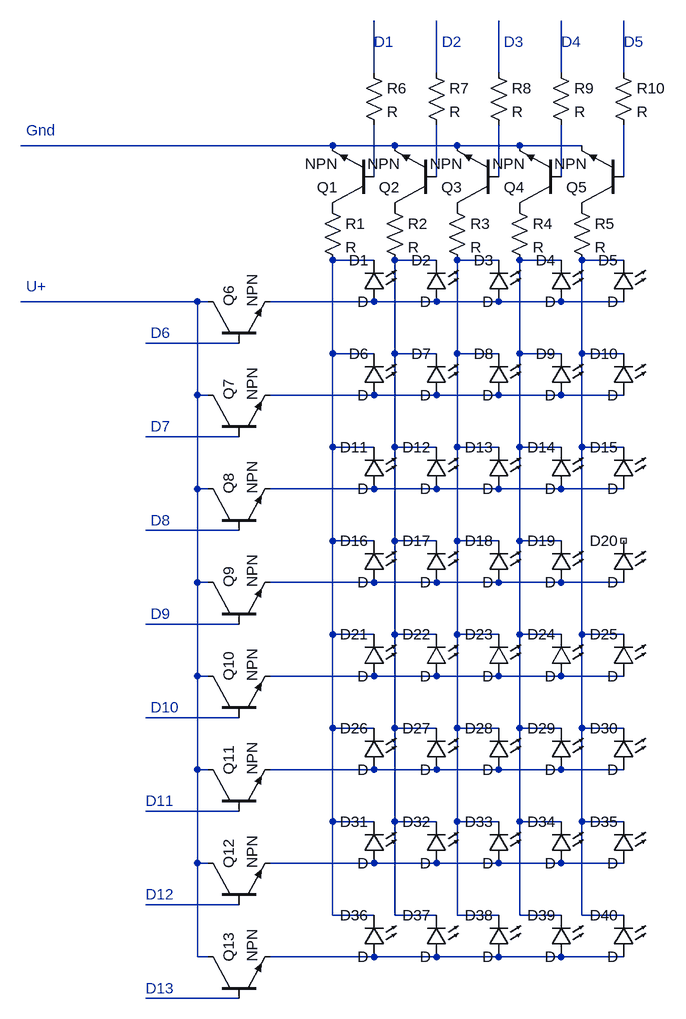
[diagram p0: schematic 5x8_LED_Matrix.asc]
5x8_LED_Matrix.asc, the LTspice schematic file:
Version 4
SHEET 1 880 1224
WIRE 112 -208 112 -288
WIRE 208 -208 208 -288
WIRE 304 -208 304 -288
WIRE 400 -208 400 -288
WIRE 496 -208 496 -288
WIRE 48 -96 -432 -96
WIRE 144 -96 48 -96
WIRE 240 -96 144 -96
WIRE 336 -96 240 -96
WIRE 432 -96 336 -96
WIRE 112 -48 112 -128
WIRE 208 -48 208 -128
WIRE 304 -48 304 -128
WIRE 400 -48 400 -128
WIRE 496 -48 496 -128
WIRE 112 80 48 80
WIRE 208 80 144 80
WIRE 304 80 240 80
WIRE 400 80 336 80
WIRE 496 80 432 80
WIRE -160 144 -432 144
WIRE -144 144 -160 144
WIRE 112 144 -48 144
WIRE 208 144 112 144
WIRE 304 144 208 144
WIRE 400 144 304 144
WIRE 496 144 400 144
WIRE -96 208 -240 208
WIRE 48 224 48 80
WIRE 112 224 48 224
WIRE 144 224 144 80
WIRE 208 224 144 224
WIRE 240 224 240 80
WIRE 304 224 240 224
WIRE 336 224 336 80
WIRE 400 224 336 224
WIRE 432 224 432 80
WIRE 496 224 432 224
WIRE -160 288 -160 144
WIRE -144 288 -160 288
WIRE 112 288 -48 288
WIRE 208 288 112 288
WIRE 304 288 208 288
WIRE 400 288 304 288
WIRE 496 288 400 288
WIRE -96 352 -240 352
WIRE 48 368 48 224
WIRE 112 368 48 368
WIRE 144 368 144 224
WIRE 208 368 144 368
WIRE 240 368 240 224
WIRE 304 368 240 368
WIRE 336 368 336 224
WIRE 400 368 336 368
WIRE 432 368 432 224
WIRE 496 368 432 368
WIRE -160 432 -160 288
WIRE -144 432 -160 432
WIRE 112 432 -48 432
WIRE 208 432 112 432
WIRE 304 432 208 432
WIRE 400 432 304 432
WIRE 496 432 400 432
WIRE -96 496 -240 496
WIRE 48 512 48 368
WIRE 112 512 48 512
WIRE 144 512 144 368
WIRE 208 512 144 512
WIRE 240 512 240 368
WIRE 304 512 240 512
WIRE 336 512 336 368
WIRE 400 512 336 512
WIRE -160 576 -160 432
WIRE -144 576 -160 576
WIRE 112 576 -48 576
WIRE 208 576 112 576
WIRE 304 576 208 576
WIRE 400 576 304 576
WIRE 496 576 400 576
WIRE -96 640 -240 640
WIRE 48 656 48 512
WIRE 112 656 48 656
WIRE 144 656 144 512
WIRE 208 656 144 656
WIRE 240 656 240 512
WIRE 304 656 240 656
WIRE 336 656 336 512
WIRE 400 656 336 656
WIRE 432 656 432 368
WIRE 496 656 432 656
WIRE -160 720 -160 576
WIRE -144 720 -160 720
WIRE 112 720 -48 720
WIRE 208 720 112 720
WIRE 304 720 208 720
WIRE 400 720 304 720
WIRE 496 720 400 720
WIRE -96 784 -240 784
WIRE 48 800 48 656
WIRE 112 800 48 800
WIRE 144 800 144 656
WIRE 208 800 144 800
WIRE 240 800 240 656
WIRE 304 800 240 800
WIRE 336 800 336 656
WIRE 400 800 336 800
WIRE 432 800 432 656
WIRE 496 800 432 800
WIRE -160 864 -160 720
WIRE -144 864 -160 864
WIRE 112 864 -48 864
WIRE 208 864 112 864
WIRE 304 864 208 864
WIRE 400 864 304 864
WIRE 496 864 400 864
WIRE -96 928 -240 928
WIRE 48 944 48 800
WIRE 112 944 48 944
WIRE 144 944 144 800
WIRE 208 944 144 944
WIRE 240 944 240 800
WIRE 304 944 240 944
WIRE 336 944 336 800
WIRE 400 944 336 944
WIRE 432 944 432 800
WIRE 496 944 432 944
WIRE -160 1008 -160 864
WIRE -144 1008 -160 1008
WIRE 112 1008 -48 1008
WIRE 208 1008 112 1008
WIRE 304 1008 208 1008
WIRE 400 1008 304 1008
WIRE 496 1008 400 1008
WIRE -96 1072 -240 1072
WIRE 48 1088 48 944
WIRE 112 1088 48 1088
WIRE 144 1088 144 944
WIRE 208 1088 144 1088
WIRE 240 1088 240 944
WIRE 304 1088 240 1088
WIRE 336 1088 336 944
WIRE 400 1088 336 1088
WIRE 432 1088 432 944
WIRE 496 1088 432 1088
WIRE -160 1152 -160 1008
WIRE -144 1152 -160 1152
WIRE 112 1152 -48 1152
WIRE 208 1152 112 1152
WIRE 304 1152 208 1152
WIRE 400 1152 304 1152
WIRE 496 1152 400 1152
WIRE -96 1216 -240 1216
SYMBOL LED 128 144 R180
WINDOW 0 24 64 Left 2
WINDOW 3 24 0 Left 2
SYMATTR InstName D1
SYMBOL LED 224 144 R180
WINDOW 0 24 64 Left 2
WINDOW 3 24 0 Left 2
SYMATTR InstName D2
SYMBOL LED 320 144 R180
WINDOW 0 24 64 Left 2
WINDOW 3 24 0 Left 2
SYMATTR InstName D3
SYMBOL LED 416 144 R180
WINDOW 0 24 64 Left 2
WINDOW 3 24 0 Left 2
SYMATTR InstName D4
SYMBOL LED 512 144 R180
WINDOW 0 24 64 Left 2
WINDOW 3 24 0 Left 2
SYMATTR InstName D5
SYMBOL LED 128 288 R180
WINDOW 0 24 64 Left 2
WINDOW 3 24 0 Left 2
SYMATTR InstName D6
SYMBOL LED 224 288 R180
WINDOW 0 24 64 Left 2
WINDOW 3 24 0 Left 2
SYMATTR InstName D7
SYMBOL LED 320 288 R180
WINDOW 0 24 64 Left 2
WINDOW 3 24 0 Left 2
SYMATTR InstName D8
SYMBOL LED 416 288 R180
WINDOW 0 24 64 Left 2
WINDOW 3 24 0 Left 2
SYMATTR InstName D9
SYMBOL LED 512 288 R180
WINDOW 0 24 64 Left 2
WINDOW 3 24 0 Left 2
SYMATTR InstName D10
SYMBOL LED 128 432 R180
WINDOW 0 24 64 Left 2
WINDOW 3 24 0 Left 2
SYMATTR InstName D11
SYMBOL LED 224 432 R180
WINDOW 0 24 64 Left 2
WINDOW 3 24 0 Left 2
SYMATTR InstName D12
SYMBOL LED 320 432 R180
WINDOW 0 24 64 Left 2
WINDOW 3 24 0 Left 2
SYMATTR InstName D13
SYMBOL LED 416 432 R180
WINDOW 0 24 64 Left 2
WINDOW 3 24 0 Left 2
SYMATTR InstName D14
SYMBOL LED 512 432 R180
WINDOW 0 24 64 Left 2
WINDOW 3 24 0 Left 2
SYMATTR InstName D15
SYMBOL LED 128 576 R180
WINDOW 0 24 64 Left 2
WINDOW 3 24 0 Left 2
SYMATTR InstName D16
SYMBOL LED 224 576 R180
WINDOW 0 24 64 Left 2
WINDOW 3 24 0 Left 2
SYMATTR InstName D17
SYMBOL LED 320 576 R180
WINDOW 0 24 64 Left 2
WINDOW 3 24 0 Left 2
SYMATTR InstName D18
SYMBOL LED 416 576 R180
WINDOW 0 24 64 Left 2
WINDOW 3 24 0 Left 2
SYMATTR InstName D19
SYMBOL LED 512 576 R180
WINDOW 0 24 64 Left 2
WINDOW 3 24 0 Left 2
SYMATTR InstName D20
SYMBOL LED 128 720 R180
WINDOW 0 24 64 Left 2
WINDOW 3 24 0 Left 2
SYMATTR InstName D21
SYMBOL LED 224 720 R180
WINDOW 0 24 64 Left 2
WINDOW 3 24 0 Left 2
SYMATTR InstName D22
SYMBOL LED 320 720 R180
WINDOW 0 24 64 Left 2
WINDOW 3 24 0 Left 2
SYMATTR InstName D23
SYMBOL LED 416 720 R180
WINDOW 0 24 64 Left 2
WINDOW 3 24 0 Left 2
SYMATTR InstName D24
SYMBOL LED 512 720 R180
WINDOW 0 24 64 Left 2
WINDOW 3 24 0 Left 2
SYMATTR InstName D25
SYMBOL LED 128 864 R180
WINDOW 0 24 64 Left 2
WINDOW 3 24 0 Left 2
SYMATTR InstName D26
SYMBOL LED 224 864 R180
WINDOW 0 24 64 Left 2
WINDOW 3 24 0 Left 2
SYMATTR InstName D27
SYMBOL LED 320 864 R180
WINDOW 0 24 64 Left 2
WINDOW 3 24 0 Left 2
SYMATTR InstName D28
SYMBOL LED 416 864 R180
WINDOW 0 24 64 Left 2
WINDOW 3 24 0 Left 2
SYMATTR InstName D29
SYMBOL LED 512 864 R180
WINDOW 0 24 64 Left 2
WINDOW 3 24 0 Left 2
SYMATTR InstName D30
SYMBOL LED 128 1008 R180
WINDOW 0 24 64 Left 2
WINDOW 3 24 0 Left 2
SYMATTR InstName D31
SYMBOL LED 224 1008 R180
WINDOW 0 24 64 Left 2
WINDOW 3 24 0 Left 2
SYMATTR InstName D32
SYMBOL LED 320 1008 R180
WINDOW 0 24 64 Left 2
WINDOW 3 24 0 Left 2
SYMATTR InstName D33
SYMBOL LED 416 1008 R180
WINDOW 0 24 64 Left 2
WINDOW 3 24 0 Left 2
SYMATTR InstName D34
SYMBOL LED 512 1008 R180
WINDOW 0 24 64 Left 2
WINDOW 3 24 0 Left 2
SYMATTR InstName D35
SYMBOL LED 128 1152 R180
WINDOW 0 24 64 Left 2
WINDOW 3 24 0 Left 2
SYMATTR InstName D36
SYMBOL LED 224 1152 R180
WINDOW 0 24 64 Left 2
WINDOW 3 24 0 Left 2
SYMATTR InstName D37
SYMBOL LED 320 1152 R180
WINDOW 0 24 64 Left 2
WINDOW 3 24 0 Left 2
SYMATTR InstName D38
SYMBOL LED 416 1152 R180
WINDOW 0 24 64 Left 2
WINDOW 3 24 0 Left 2
SYMATTR InstName D39
SYMBOL LED 512 1152 R180
WINDOW 0 24 64 Left 2
WINDOW 3 24 0 Left 2
SYMATTR InstName D40
SYMBOL res 32 -16 R0
SYMATTR InstName R1
SYMBOL res 128 -16 R0
SYMATTR InstName R2
SYMBOL res 224 -16 R0
SYMATTR InstName R3
SYMBOL res 320 -16 R0
SYMATTR InstName R4
SYMBOL res 416 -16 R0
SYMATTR InstName R5
SYMBOL npn 112 0 R180
SYMATTR InstName Q1
SYMBOL npn 208 0 R180
SYMATTR InstName Q2
SYMBOL npn 304 0 R180
SYMATTR InstName Q3
SYMBOL npn 400 0 R180
SYMATTR InstName Q4
SYMBOL npn 496 0 R180
SYMATTR InstName Q5
SYMBOL res 96 -224 R0
SYMATTR InstName R6
SYMBOL res 192 -224 R0
SYMATTR InstName R7
SYMBOL res 288 -224 R0
SYMATTR InstName R8
SYMBOL res 384 -224 R0
SYMATTR InstName R9
SYMBOL res 480 -224 R0
SYMATTR InstName R10
SYMBOL npn -144 208 R270
SYMATTR InstName Q6
SYMBOL npn -144 352 R270
SYMATTR InstName Q7
SYMBOL npn -144 496 R270
SYMATTR InstName Q8
SYMBOL npn -144 640 R270
SYMATTR InstName Q9
SYMBOL npn -144 784 R270
SYMATTR InstName Q10
SYMBOL npn -144 928 R270
SYMATTR InstName Q11
SYMBOL npn -144 1072 R270
SYMATTR InstName Q12
SYMBOL npn -144 1216 R270
SYMATTR InstName Q13
TEXT 112 -256 Left 2 ;D1
TEXT 216 -256 Left 2 ;D2
TEXT 312 -256 Left 2 ;D3
TEXT 400 -256 Left 2 ;D4
TEXT 496 -256 Left 2 ;D5
TEXT -424 -120 Left 2 ;Gnd
TEXT -232 336 Left 2 ;D7
TEXT -232 480 Left 2 ;D8
TEXT -232 624 Left 2 ;D9
TEXT -232 768 Left 2 ;D10
TEXT -240 912 Left 2 ;D11
TEXT -240 1056 Left 2 ;D12
TEXT -240 1200 Left 2 ;D13
TEXT -232 192 Left 2 ;D6
TEXT -424 120 Left 2 ;U+

The netlist it stands for:
* 5x8_LED_Matrix.asc
D1 N018 N012 D
D2 N018 N013 D
D3 N018 N014 D
D4 N018 N015 D
D5 N018 N016 D
D6 N020 N012 D
D7 N020 N013 D
D8 N020 N014 D
D9 N020 N015 D
D10 N020 N016 D
D11 N022 N012 D
D12 N022 N013 D
D13 N022 N014 D
D14 N022 N015 D
D15 N022 N016 D
D16 N024 N012 D
D17 N024 N013 D
D18 N024 N014 D
D19 N024 N015 D
D20 N024 NC_01 D
D21 N026 N012 D
D22 N026 N013 D
D23 N026 N014 D
D24 N026 N015 D
D25 N026 N016 D
D26 N028 N012 D
D27 N028 N013 D
D28 N028 N014 D
D29 N028 N015 D
D30 N028 N016 D
D31 N030 N012 D
D32 N030 N013 D
D33 N030 N014 D
D34 N030 N015 D
D35 N030 N016 D
D36 N032 N012 D
D37 N032 N013 D
D38 N032 N014 D
D39 N032 N015 D
D40 N032 N016 D
R1 P001 N012 R
R2 P002 N013 R
R3 P003 N014 R
R4 P004 N015 R
R5 P005 N016 R
Q1 P001 N007 N006 0 NPN
Q2 P002 N008 N006 0 NPN
Q3 P003 N009 N006 0 NPN
Q4 P004 N010 N006 0 NPN
Q5 P005 N011 N006 0 NPN
R6 N001 N007 R
R7 N002 N008 R
R8 N003 N009 R
R9 N004 N010 R
R10 N005 N011 R
Q6 N017 N019 N018 0 NPN
Q7 N017 N021 N020 0 NPN
Q8 N017 N023 N022 0 NPN
Q9 N017 N025 N024 0 NPN
Q10 N017 N027 N026 0 NPN
Q11 N017 N029 N028 0 NPN
Q12 N017 N031 N030 0 NPN
Q13 N017 N033 N032 0 NPN
.model D D
.lib standard.dio
.model NPN NPN
.model PNP PNP
.lib standard.bjt
* D1
* D2
* D3
* D4
* D5
* Gnd
* D7
* D8
* D9
* D10
* D11
* D12
* D13
* D6
* U+
.backanno
.end